# EAGLE design obc_v2_rev_6 (EAGLE 7.3.0)
OBC with integrated microcontroller
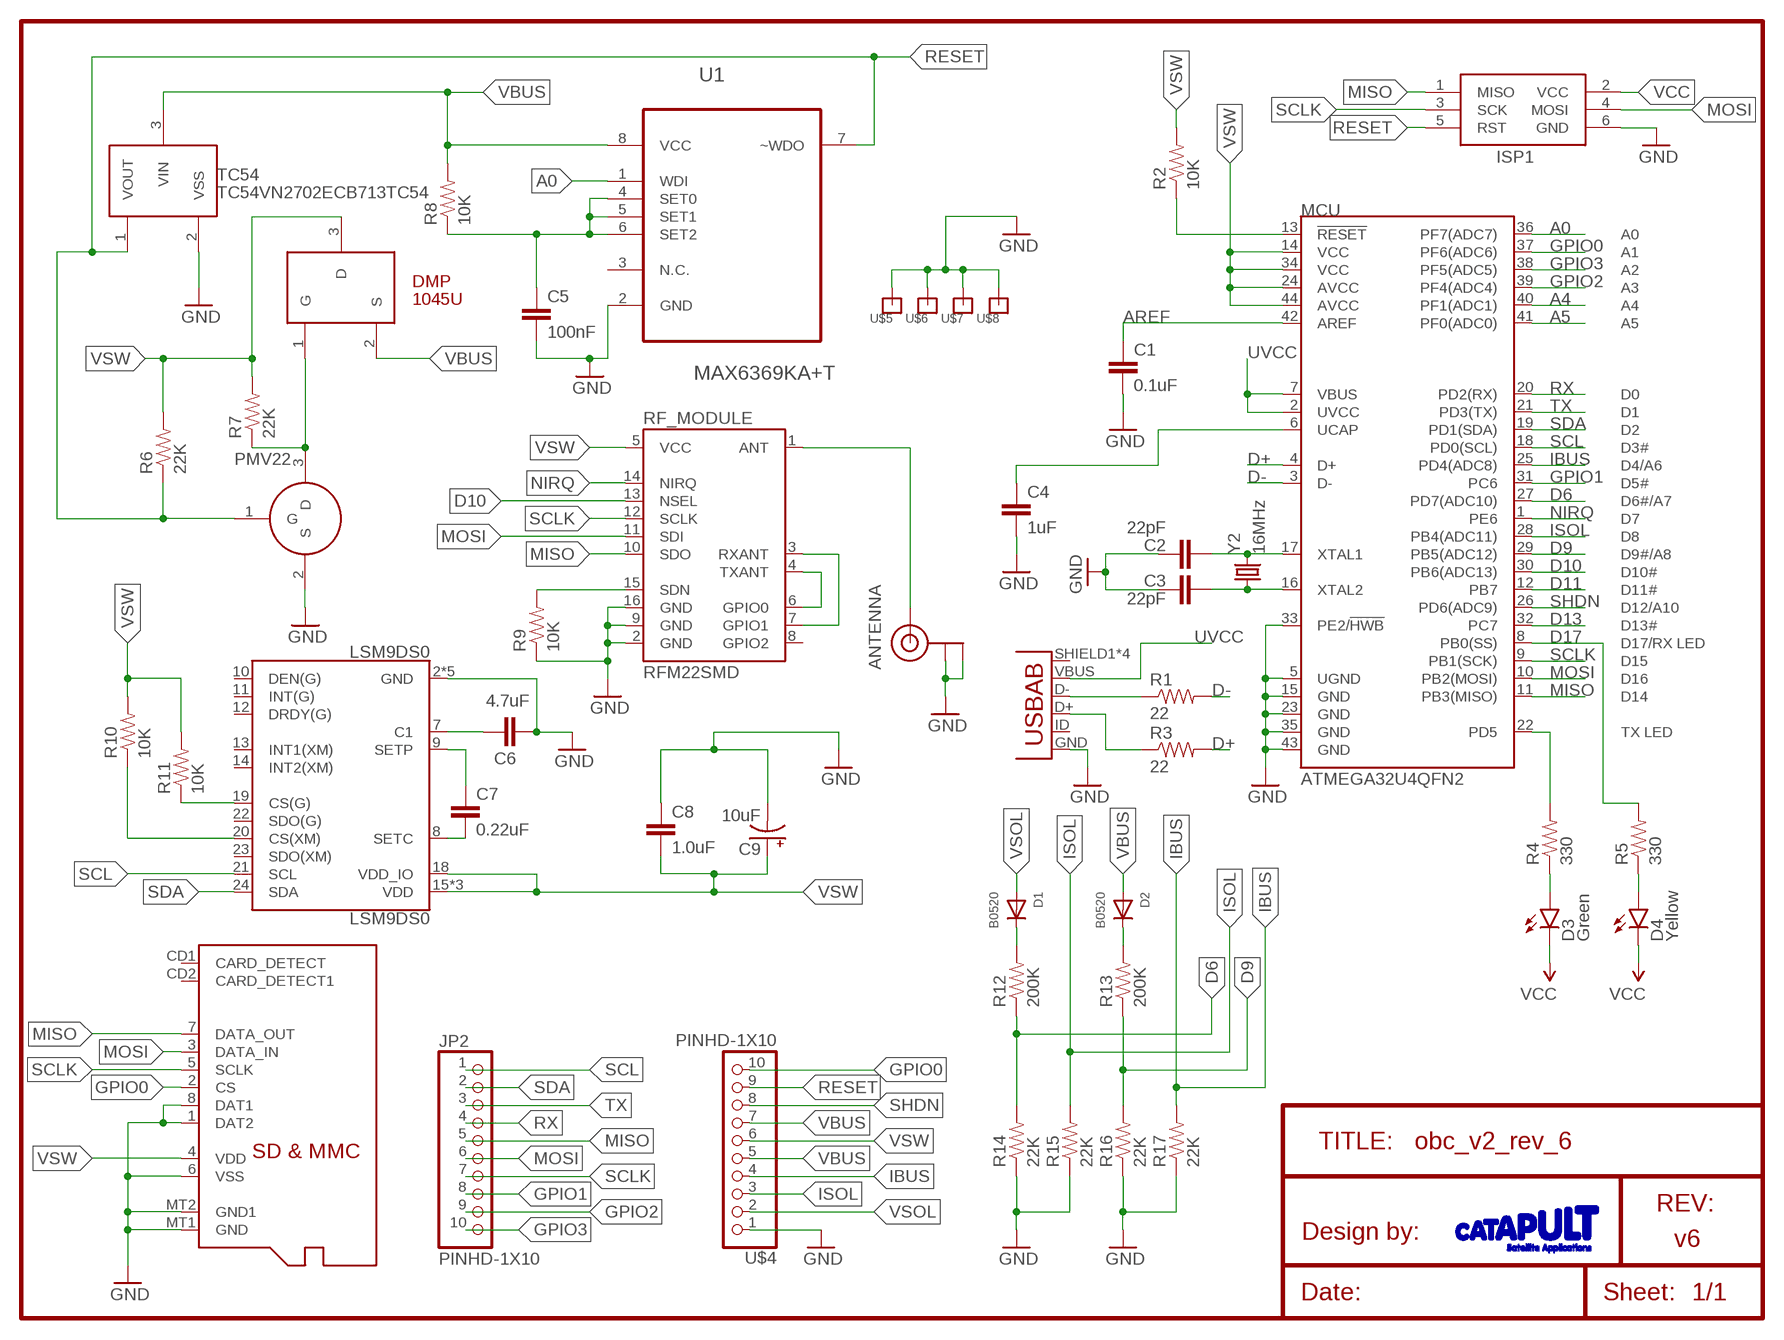
[diagram p0: schematic, sheet 1]

## Parts
ANTENNA  U.FL  [U.FL]
C1  0.1uF  CAP0603-CAP  [0603-CAP]
C2  22pF  CAP0603-CAP  [0603-CAP]
C3  22pF  CAP0603-CAP  [0603-CAP]
C4  1uF  CAP0603-CAP  [0603-CAP]
C5  100nF  CAP0402-CAP  [0402-CAP]
C6  4.7uF  CAP0402-CAP  [0402-CAP]
C7  0.22uF  CAP0402-CAP  [0402-CAP]
C8  1.0uF  CAP0402-CAP  [0402-CAP]
C9  10uF  CAP_POL1206  [EIA3216]
D1  B0520  DIODESOD-123  [SOD-123]
D2  B0520  DIODESOD-123  [SOD-123]
D3  Green  LED0603  [LED-0603]
D4  Yellow  LED0603  [LED-0603]
DMP  1045U  DMP1045USMD  [SOT-23_DMP]
ISP1  AVRISP-6  [AVRISP]
JP1  USB-AB  [USB-AB-MICRO-SMD]
JP2  PINHD-1X10  [1X10-BIG]
LSM9DS0  LSM9DS0  [LGA-24]
MCU  ATMEGA32U4QFN2  [QFN-44-NOPAD]
PMV22  PMV22SMD  [SOT-23]
R1  22  RESISTOR0603-RES  [0603-RES]
R2  10K  RESISTOR0603-RES  [0603-RES]
R3  22  RESISTOR0603-RES  [0603-RES]
R4  330  RESISTOR0603-RES  [0603-RES]
R5  330  RESISTOR0603-RES  [0603-RES]
R6  22K  RESISTOR0402-RES  [0402-RES]
R7  22K  RESISTOR0402-RES  [0402-RES]
R8  10K  RESISTOR0402-RES  [0402-RES]
R9  10K  RESISTOR0402-RES  [0402-RES]
R10  10K  RESISTOR0402-RES  [0402-RES]
R11  10K  RESISTOR0402-RES  [0402-RES]
R12  200K  RESISTOR0402-RES  [0402-RES]
R13  200K  RESISTOR0402-RES  [0402-RES]
R14  22K  RESISTOR0402-RES  [0402-RES]
R15  22K  RESISTOR0402-RES  [0402-RES]
R16  22K  RESISTOR0402-RES  [0402-RES]
R17  22K  RESISTOR0402-RES  [0402-RES]
RF_MODULE  RFM22SMD  [RFM22-XXX-S2]
SD  MICROSD  [MICROSD]
TC54  TC54VN2702ECB713TC54  [SOT-23A]
U1  MAX6369KA+T  [SOT65P280X145-8N]
U$4  PINHD-1X10  [1X10-BIG]
U$5  3MMPILAR  [3MMPILAR]
U$6  3MMPILAR  [3MMPILAR]
U$7  3MMPILAR  [3MMPILAR]
U$8  3MMPILAR  [3MMPILAR]
Y2  16MHz  CRYSTAL5X3  [CRYSTAL-SMD-5X3]

## Nets
A0: MCU.36(PF7(ADC7)) U1.1(WDI)
A4: MCU.40(PF1(ADC1))
A5: MCU.41(PF0(ADC0))
AREF: C1.1 MCU.42(AREF)
D6: MCU.27(PD7(ADC10)) R12.1 R14.2
D9: MCU.29(PB5(ADC12)) R13.1 R16.2
D10: MCU.30(PB6(ADC13)) RF_MODULE.13(NSEL)
D11: MCU.12(PB7)
D13: MCU.32(PC7)
D17: MCU.8(PB0(SS)) R5.2
D+: MCU.4(D+) R3.2
D-: MCU.3(D-) R1.2
GND: ANTENNA.P$1(GND) ANTENNA.P$2(GND) C1.2 C2.1 C3.1 C4.2 C5.2 C6.1 C8.1 C9.C(-) ISP1.6(GND) JP1.GND LSM9DS0.2(GND) LSM9DS0.3(GND) LSM9DS0.4(GND) LSM9DS0.5(GND) LSM9DS0.6(GND) MCU.5(UGND) MCU.15(GND) MCU.23(GND) MCU.33(PE2/!HWB) MCU.35(GND) MCU.43(GND) PMV22.2(S) R9.1 R14.1 R15.1 R16.1 R17.1 RF_MODULE.2(GND) RF_MODULE.9(GND) RF_MODULE.16(GND) SD.1(DAT2) SD.6(VSS) SD.8(DAT1) SD.MT1(GND) SD.MT2(GND1) TC54.2(VSS) U1.2(GND) U$4.1 U$5.P$1 U$6.P$1 U$7.P$1 U$8.P$1
GPIO0: MCU.37(PF6(ADC6)) SD.2(CS) U$4.10
GPIO1: JP2.8 MCU.31(PC6)
GPIO2: JP2.9 MCU.39(PF4(ADC4))
GPIO3: JP2.10 MCU.38(PF5(ADC5))
IBUS: MCU.25(PD4(ADC8)) R17.2 U$4.4
ISOL: MCU.28(PB4(ADC11)) R15.2 U$4.3
MISO: ISP1.1(MISO) JP2.5 MCU.11(PB3(MISO)) RF_MODULE.10(SDO) SD.7(DATA_OUT)
MOSI: ISP1.4(MOSI) JP2.6 MCU.10(PB2(MOSI)) RF_MODULE.11(SDI) SD.3(DATA_IN)
N$1: MCU.13(!RESET) R2.1
N$2: C4.1 MCU.6(UCAP)
N$3: C3.2 MCU.16(XTAL2) Y2.1
N$4: C2.2 MCU.17(XTAL1) Y2.3
N$5: JP1.D+ R3.1
N$6: JP1.D- R1.1
N$7: MCU.22(PD5) R4.2
N$8: DMP.1(G) PMV22.3(D) R7.1
N$9: D4.A R5.1
N$10: D3.A R4.1
N$11: C5.1 R8.1 U1.4(SET0) U1.5(SET1) U1.6(SET2)
N$12: RF_MODULE.4(TXANT) RF_MODULE.6(GPIO0)
N$13: RF_MODULE.3(RXANT) RF_MODULE.7(GPIO1)
N$14: ANTENNA.P$3(SIGNAL) RF_MODULE.1(ANT)
N$15: C6.2 LSM9DS0.7(C1)
N$16: R9.2 RF_MODULE.15(SDN)
N$17: D1.C R12.2
N$18: LSM9DS0.19(CS(G)) R11.1
N$19: LSM9DS0.20(CS(XM)) R10.1
N$20: C7.1 LSM9DS0.9(SETP)
N$21: C7.2 LSM9DS0.8(SETC)
N$26: D2.C R13.2
NIRQ: MCU.1(PE6) RF_MODULE.14(NIRQ)
RESET: ISP1.5(RST) PMV22.1(G) R6.1 TC54.1(VOUT) U1.7(~WDO) U$4.9
RX: JP2.4 MCU.20(PD2(RX))
SCL: JP2.1 LSM9DS0.21(SCL) MCU.18(PD0(SCL))
SCLK: ISP1.3(SCK) JP2.7 MCU.9(PB1(SCK)) RF_MODULE.12(SCLK) SD.5(SCLK)
SDA: JP2.2 LSM9DS0.24(SDA) MCU.19(PD1(SDA))
SHDN: MCU.26(PD6(ADC9)) U$4.8
TX: JP2.3 MCU.21(PD3(TX))
UVCC: JP1.VBUS MCU.2(UVCC) MCU.7(VBUS)
VBUS: D2.A DMP.2(S) R8.2 TC54.3(VIN) U1.8(VCC) U$4.5 U$4.7
VCC: D3.C D4.C ISP1.2(VCC)
VSOL: D1.A U$4.2
VSW: C8.2 C9.A(+) DMP.3(D) LSM9DS0.15(VDD) LSM9DS0.16(VDD) LSM9DS0.17(VDD) LSM9DS0.18(VDD_IO) MCU.14(VCC) MCU.24(AVCC) MCU.34(VCC) MCU.44(AVCC) R2.2 R6.2 R7.2 R10.2 R11.2 RF_MODULE.5(VCC) SD.4(VDD) U$4.6
Unconnected: JP1.ID(USBID) JP1.SHIELD1(SHIELD) JP1.SHIELD2(SHIELD) JP1.SHIELD3(SHIELD) JP1.SHIELD4(SHIELD) LSM9DS0.10(DEN(G)) LSM9DS0.11(INT(G)) LSM9DS0.12(DRDY(G)) LSM9DS0.13(INT1(XM)) LSM9DS0.14(INT2(XM)) LSM9DS0.22(SDO(G)) LSM9DS0.23(SDO(XM)) RF_MODULE.8(GPIO2) SD.CD1(CARD_DETECT) SD.CD2(CARD_DETECT1) U1.3(N.C.)

## Notes on the sheet
- TITLE:
- REV:
- Design by:
- v6
- Date: | Sheet:
- C:/Users/George.Addison/Documents/hardware/Electronic/PCB Designs/SA_LG_Black.bmp

## Library data of the parts
ANTENNA = SparkFun-Connectors:U.FL: SMD antenna connector- WRL-09144; PROD_ID: CONN-09193
C1-C8 = SparkFun-Capacitors:CAP: Capacitor Standard 0603 ceramic capacitor, and 0.1" leaded capacitor.
C9 = SparkFun-Capacitors:CAP_POL: Capacitor Polarized These are standard SMD and PTH capacitors. Normally 10uF, 47uF, and 100uF in electrolytic and tantalum varieties. Always verify the external diameter of the through hole cap, it varies with capacity, voltage, and manufacturer. The EIA devices should be standard.
D1 D2 = adafruit:DIODE: Diode SMADIODE - SMA Surface Mount Package 20V 1A Schottky Diode Digikey: 641-1014-6-ND DO-1N4148 - Through Hole Small Current Diode SOD-123 20V 1 A (.5mV Vf) Schottky Diode - Digikey: MBRX120TPMSCT-ND SOD-323 10V 570mA (.38mV Vf, 3ns) Schottky Diode - Digikey: ZLLS410CT-ND SOD-523 30V 30mA Schottky Diode (RB751S-40TE61) - Digikey: RB751S-40TE61CT-ND SOT23-R/W - SOT23 Package (R = Solder Paste/Reflow Ovens, W = Hand-Soldering) BAT54Film 40V 300mA - Digikey: 497-7162-1-ND
D3 D4 = SparkFun-LED:LED: LEDs Standard schematic elements and footprints for 5mm, 3mm, 1206, and 0603 sized LEDs. 5mm - Spark Fun Electronics SKU : COM-00529 (and others)
DMP = OBC:DMP1045U: P-CHANNEL ENHANCEMENT MODE MOSFET
ISP1 = adafruit:AVRISP: AVR ISP HEADER Standard 6 pin header for AVR programming
JP1 = SparkFun-Connectors:USB-AB: This is a USB AB connector that is compatible with USB OTG. i.e. this connector can serve as a host or device
JP2 U$4 = adafruit:PINHD-1X10: Pin header 1x10 0.1" spacing With round pins
LSM9DS0 = SparkFun-DigitalIC:LSM9DS0: LSM9DS0 3D Accelerometer, 3D Gyroscope, 3D Magnetomter Features: 3 acceleration channels, 3 angular rate channels, 3 magnetic field channels ±2/±4/±6/±8/±16 g linear acceleration full scale ±2/±4/±8/±12 gauss magnetic full scale ±245/±500/±2000 dps angular rate full scale 16-bit data output SPI / I2C serial interfaces Analog supply voltage 2.4 V to 3.6 V Power-down mode / low-power mode Programmable interrupt generators Embedded self-test Embedded temperature sensor Embedded FIFO Position and motion detection functions Click/double-click recognition
MCU = SparkFun-DigitalIC:ATMEGA32U4: Atmel 44-pin 8-bit Microcontroller with 32KBytes of ISP Flash and USB Controller
PMV22 = OBC:PMV22
R1-R17 = SparkFun-Passives:RESISTOR: Resistor Basic schematic elements and footprints for 0603, 1206, and PTH resistors.
RF_MODULE = SparkFun-RF:RFM22: The RFM22 is a low-power, low cost radio that is capable of operating in the 434MHz and 900MHz open bands. It's frequency is software defined and there are some very good libraries written for it.
SD = adafruit:MICROSD: Micro-SD / Transflash card holder with SPI pinout For the 3M # 2908-05WB-MG and/or 4UCON #19656 push-push type
TC54 = OBC:TC54VN2702ECB713: VOLTAGE DETECTOR, 3.6UA, 10V, SMD-3
U1 = Maxim_By_element14_Batch_1:MAX6369KA+T: Pin-Selectable Watchdog Timers; MPN: MAX6369KA+T; OC_FARNELL: 1787051; OC_NEWARK: 68K9450; PACKAGE: SOT23-8; SUPPLIER: Maxim
U$5-U$8 = LMA:3MMPILAR
Y2 = SparkFun-FreqCtrl:CRYSTAL: Various standard crystals. Proven footprints.; PROD_ID: XTAL-08218

## Board
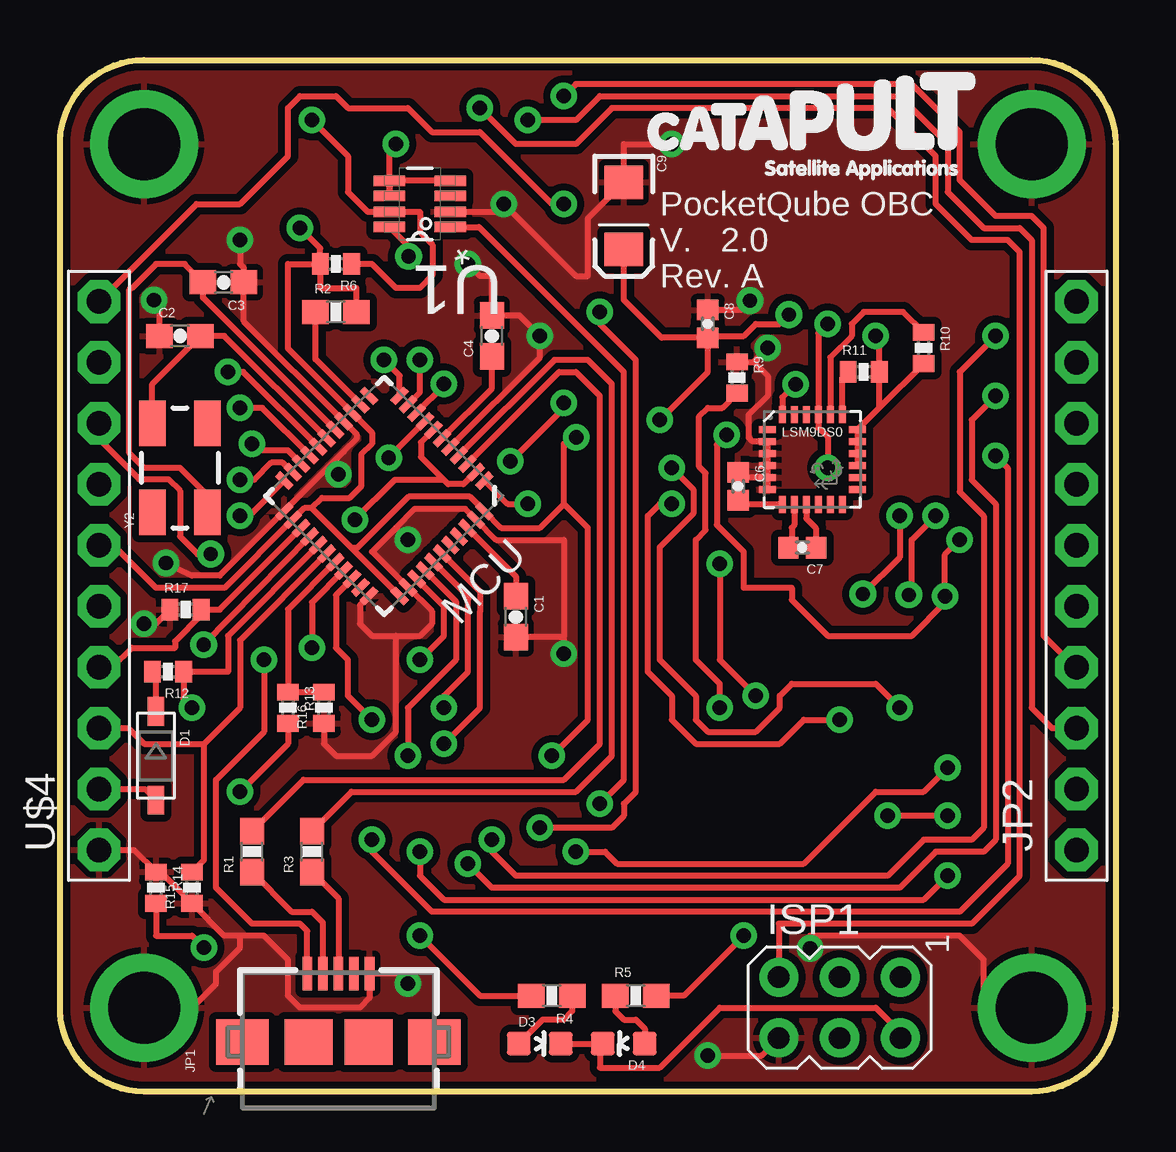
[diagram p1: board, top side]
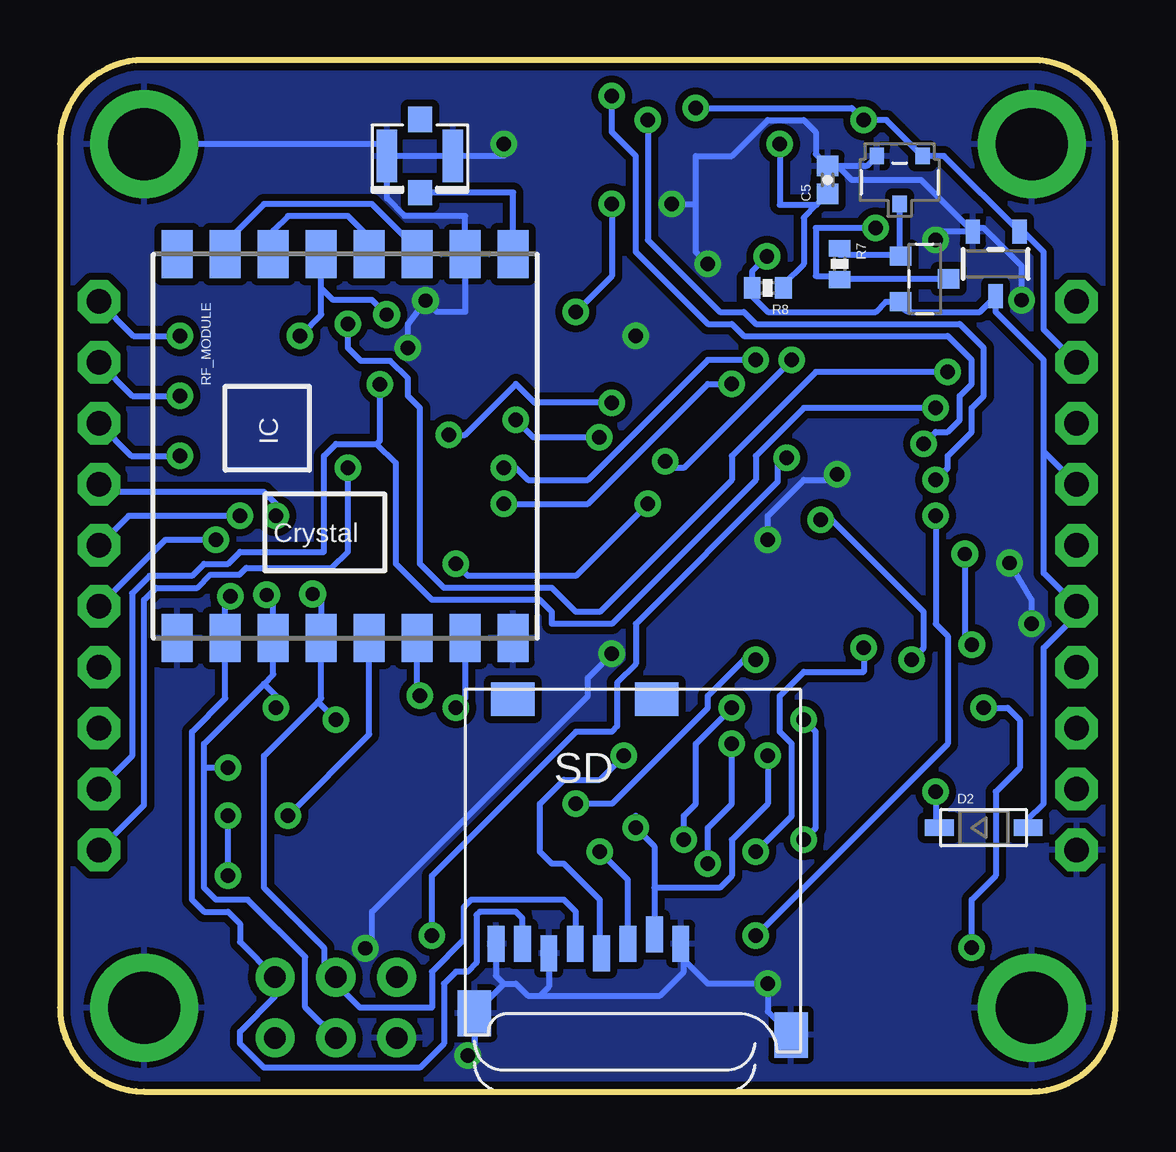
[diagram p2: board, bottom side, seen from below]

Size 44 x 43 mm. Coordinates in mm from the lower left corner, seen from the top.
Outline: 0,3.5 0,39.5 arc-90 3.5,43 40.5,43 arc-90 44,39.5 44,3.5 arc-90 40.5,0 3.5,0 arc-90 0,3.5
Copper layers (1*16): Top 0.035mm / dielectric 1.5mm / Bottom 0.035mm
Design rules "pcbtrain *": minimum track width 0.2mm, minimum drill 0.4mm, track to track 0.2mm, track to pad 0.2mm, pad to pad 0.2mm, via to via 0.2mm, smd to smd 0mil, copper to edge 10mil, drill to drill 0.2mm, minimum pad ring 10mil, minimum via ring 10mil, stop-mask expansion 0.125mm, vias tented up to drill 25mil, thermal gap 10mil

### Footprints (pad centres in the part's own frame; a part is rotated, then mirrored left to right if it is on the bottom)
U.FL = smd 2.2 x 0.85: P$1 0,1.375; P$2 0,-1.375 | smd 1.05 x 1: P$3 1.525,0; P$4 -1.525,0
0603-CAP = smd 1.1 x 1: 1 -0.85,0; 2 0.85,0
0402-CAP = smd 0.85 x 0.9: 1 -0.58,0; 2 0.58,0
EIA3216 = smd 1.4 x 1.6: A 1.4,0; C -1.4,0
SOD-123 = smd 1.2 x 0.7: A 1.85,0; C -1.85,0
LED-0603 = smd 1 x 1: A 0,-0.877; C 0,0.877
SOT-23_DMP = smd 0.8 x 0.9: 1 -0.95,-1; 2 0.95,-1; 3 0,1
AVRISP = drill 0.9 pad 1.626: 1 -1.27,2.54; 2 1.27,2.54; 3 -1.27,0; 4 1.27,0; 5 -1.27,-2.54; 6 1.27,-2.54
USB-AB-MICRO-SMD = smd 1.4 x 0.4: D+ 2.85,0; D- 2.85,0.65; GND 2.85,-1.3; ID 2.85,-0.65; VBUS 2.85,1.3 | smd 1.9 x 2.2: SHIELD1 0,4; SHIELD4 0,-4 | smd 1.9 x 2: SHIELD2 0,1.25; SHIELD3 0,-1.25
1X10-BIG = drill 1.016 pad 1.778 octagon: 1 -11.43,0; 2 -8.89,0; 3 -6.35,0; 4 -3.81,0; 5 -1.27,0; 6 1.27,0; 7 3.81,0; 8 6.35,0; 9 8.89,0; 10 11.43,0
LGA-24 = smd 0.7 x 0.29: 1 -1.875,1.25; 2 -1.875,0.75; 3 -1.875,0.25; 4 -1.875,-0.25; 5 -1.875,-0.75; 6 -1.875,-1.25; 13 1.875,-1.25; 14 1.875,-0.75; 15 1.875,-0.25; 16 1.875,0.25; 17 1.875,0.75; 18 1.875,1.25 | smd 0.29 x 0.7: 7 -1.25,-1.875; 8 -0.75,-1.875; 9 -0.25,-1.875; 10 0.25,-1.875; 11 0.75,-1.875; 12 1.25,-1.875; 19 1.25,1.875; 20 0.75,1.875; 21 0.25,1.875; 22 -0.25,1.875; 23 -0.75,1.875; 24 -1.25,1.875
QFN-44-NOPAD = smd 0.8 x 0.3: 1 -3.4,2.5; 2 -3.4,2; 3 -3.4,1.5; 4 -3.4,1; 5 -3.4,0.5; 6 -3.4,0; 7 -3.4,-0.5; 8 -3.4,-1; 9 -3.4,-1.5; 10 -3.4,-2; 11 -3.4,-2.5; 23 3.4,-2.5; 24 3.4,-2; 25 3.4,-1.5; 26 3.4,-1; 27 3.4,-0.5; 28 3.4,0; 29 3.4,0.5; 30 3.4,1; 31 3.4,1.5; 32 3.4,2; 33 3.4,2.5 | smd 0.3 x 0.8: 12 -2.5,-3.4; 13 -2,-3.4; 14 -1.5,-3.4; 15 -1,-3.4; 16 -0.5,-3.4; 17 0,-3.4; 18 0.5,-3.4; 19 1,-3.4; 20 1.5,-3.4; 21 2,-3.4; 22 2.5,-3.4; 34 2.5,3.4; 35 2,3.4; 36 1.5,3.4; 37 1,3.4; 38 0.5,3.4; 39 0,3.4; 40 -0.5,3.4; 41 -1,3.4; 42 -1.5,3.4; 43 -2,3.4; 44 -2.5,3.4
SOT-23 = smd 0.6 x 0.7: 1 0.95,1; 2 -0.95,1; 3 0,-1
0603-RES = smd 1.1 x 1: 1 -0.85,0; 2 0.85,0
0402-RES = smd 0.7 x 0.9: 1 -0.65,0; 2 0.65,0
RFM22-XXX-S2 = smd 2 x 1.3: 1 -8,7; 2 -8,5; 3 -8,3; 4 -8,1; 5 -8,-1; 6 -8,-3; 7 -8,-5; 8 -8,-7; 9 8,-7; 10 8,-5; 11 8,-3; 12 8,-1; 13 8,1; 14 8,3; 15 8,5; 16 8,7
MICROSD = smd 0.7 x 1.5: 1 9,-10.64; 2 7.9,-10.24; 3 6.8,-10.64; 4 5.7,-11.04; 5 4.6,-10.64; 6 3.5,-11.04; 7 2.4,-10.64; 8 1.3,-10.64 | smd 1.8 x 1.4: CD1 2,-0.44; CD2 8,-0.44 | smd 1.4 x 1.9: MT1 0.4,-13.54; MT2 13.6,-14.44
SOT-23A = smd 0.6 x 1: 1 -1,-1.35; 2 0.95,-1.35; 3 0,1.35
SOT65P280X145-8N = smd 1.321 x 0.432: 1 -1.27,0.965; 2 -1.27,0.33; 3 -1.27,-0.33; 4 -1.27,-0.965; 5 1.27,-0.965; 6 1.27,-0.33; 7 1.27,0.33; 8 1.27,0.965
3MMPILAR = drill 3 pad 4.5: P$1 0,0
CRYSTAL-SMD-5X3 = smd 1.9 x 1.1: 1 -1.85,-1.15; 2 1.85,-1.15; 3 1.85,1.15; 4 -1.85,1.15

### Placement (x,y rotation side)
ANTENNA  29,39 270 bottom
C1  19,19.79 270 top
C2  5,31.5 0 top
C3  6.82,33.73 180 top
C4  18,31.5 90 top
C5  12,38 90 bottom
C6  28.27,25.23 270 top
C7  30.95,22.68 180 top
C8  27,32 270 top
C9  23.5,36.5 270 top
D1  4,14 270 top
D2  5.5,11 0 bottom
D3  20,2 270 top
D4  23.5,2 90 top
DMP  7.96,33.88 270 bottom
ISP1  32.5,3.5 270 top
JP1  11.61,2.07 90 top
JP2  42.38,21.5 90 top
LSM9DS0  31.36,26.35 0 top
MCU  13.52,24.83 225 top
PMV22  9,38 0 bottom
R1  8,10 90 top
R2  11.5,32.5 0 top
R3  10.5,10 90 top
R4  20.5,4 180 top
R5  24,4 0 top
R6  11.5,34.5 180 top
R7  11.5,34.5 270 bottom
R8  14.5,33.5 180 bottom
R9  28.23,29.77 270 top
R10  36,31 270 top
R11  33.5,30 0 top
R12  4.5,17.5 180 top
R13  9.5,16 270 top
R14  4,8.5 270 top
R15  5.5,8.5 90 top
R16  11,16 90 top
R17  5.24,20.09 0 top
RF_MODULE  32.11,26.9 270 bottom
SD  27.12,16.8 0 bottom
TC54  5,34.5 180 bottom
U1  15,37 180 top
U$3  [SA_LOGO]  24.5,38 0 top
U$4  1.62,21.5 90 top
U$5  40.5,39.5 0 top
U$6  3.5,39.5 0 top
U$7  40.5,3.5 0 top
U$8  3.5,3.5 0 top
Y2  5,26 90 top

### Tracks (layer width: path | path; a pad name or v marks a point on that pad's centre or on a via)
A0  (via drill 0.6)
  Top 0.254: U1.1 17.46,36.03 23.5,30 23.5,13 v22.5,12 | v15,18 16,19 16,20.23 MCU.36
  Bottom 0.254: v15,18 15.5,18 17,16.5 17,16 21,12 v22.5,12
AREF
  Top 0.254: MCU.42 19,21.47 C1.1
D6  (via drill 0.6)
  Top 0.254: 5.48,17.5 R12.1 | R12.1 5.15,16.35 v5.5,16 | v6,6 5.5,6.5 4,6.5 R14.2 | MCU.27 10.76,22.76 7,19 7,17.5 R12.1
  Bottom 0.254: v5.5,16 4.5,16 4,15.5 4,13.5 5,12.5 5,9 6,8 v6,6
D9
  Top 0.254: MCU.29 9.5,20.1 R13.1 R16.2
D10  (via drill 0.6)
  Top 0.254: MCU.30 10.5,20.4 v10.5,18.5 | v15,10 15,9 16,8 36,8 v37,9 | v37,11.5 v34.5,11.5
  Bottom 0.254: v10.5,18.5 10.5,17.5 13,17.5 14,16.5 14,15 13.5,14.5 13.5,11.5 v15,10 | v37,9 v37,11.5 | v34.5,11.5 31.11,14.89 RF_MODULE.13
D17  (via drill 0.6)
  Top 0.254: MCU.8 13.7,26.42 v13.7,26.41 | v28.5,6.5 26,4 R5.2
  Bottom 0.254: v13.7,26.41 14.09,26.41 14.09,25.41 20,19.5 20,17.82 20.78,17.05 20.78,15.22 21,15 22.5,15 28.5,9 v28.5,6.5
D+
  Top 0.254: R3.2 12.15,12.5 21.5,12.5 23,14 23,29.5 22,30.5 20.6,30.5 MCU.4
D-
  Top 0.254: R1.2 10.15,13 21,13 22.5,14.5 22.5,29 21.5,30 20.81,30 MCU.3
GND  (via drill 0.6)
  Top 0.254: v7.5,35.5 7.5,34.5 7.67,34.34 C3.1 7.67,32.1 MCU.15 12.38,27.38 12.38,27.23 11.83,26.67 | 11.33,26.17 MCU.23 6.66,21.51 5.49,21.51 v4.41,22.03 | 11.33,26.17 11.83,26.67 | 14,23.5 13,22.5 13.02,22.5 MCU.35 15.5,20.02 15.5,19.5 15,19 14,19 | v17,34.5 17.5,34 18,34 C4.2 19.15,32.35 v20,31.5 20,30.6 MCU.5 | U1.2 18.17,36.67 v18.5,37 21.5,34 22,34 22,36.4 C9.C 23.5,39.5 v25.5,39.5 | MCU.33 12.5,20.27 12.5,19.5 13,19 14,19 | R16.1 11,14.5 11.5,14 13,14 14,15 14,19 | v27,1.5 29.23,1.5 ISP1.6 | 21,18.94 21,23 18.18,23 MCU.43 16.89,24.29 14.79,24.29 14,23.5 | 21,18.94 C1.2 | LSM9DS0.5 28.48,25.6 C6.1 | LSM9DS0.5 LSM9DS0.4 LSM9DS0.3 LSM9DS0.2 28.86,27.1 28.71,27.25 28.71,28.21 29.5,29 29.5,29.83 28.91,30.41 | LSM9DS0.5 LSM9DS0.6 | v14.5,4.5 14.08,4.92 JP1.GND 12.9,3.9 12.5,3.5 10,3.5 9.5,4 9.5,5.5 8.5,6.5 7.5,6.5 | 7.5,6.5 6.85,6.5 R15.1 4.2,9.15 R14.1 3.08,10.07 U$4.1 | U$8.P$1 5.5,3.5 6.5,4.5 6.5,5 7.5,6 7.5,6.5 | U$7.P$1 38.5,3.5 38.5,5.5 37.5,6.5 31.27,6.5 v31.27,5.97 | 14,23.5 v14.5,23 | 11.83,26.67 11.54,26.37 | v11.6,25.73 11.33,26 11.33,26.17 | C2.1 4.15,32.76 v3.92,32.99 | R9.1 28.91,30.41 | 28.91,30.41 v29.5,31 | v28.76,32.97 28.37,32.58 C8.1 | v21,18.25 21,18.94 | v3.5,19.5 4,19.5 R17.1
  Bottom 0.254: TC54.2 8.1,38 11,38 11.58,38.58 C5.2 | TC54.2 7.15,35.85 v7.5,35.5 | PMV22.2 10.37,38.58 C5.2 | v3.5,19.5 3.5,20.5 v4.41,22.03 | v17,34.5 17.5,35 17.5,37 | 17.5,37 17.5,39 16,39 14.5,40.5 13,40.5 12.5,40 12.5,39.08 C5.2 | v18.5,37 17.5,37 | v27,1.5 26.73,1.77 SD.MT1 25.5,4.49 25.5,4.5 | SD.8 25.82,4.83 25.5,4.5 | 25.5,4.5 25,4.5 24.5,4 24,4 | 24,4 19,4 18,5 18,5.5 | 18,5.5 18,6.04 SD.1 | RF_MODULE.16 25.11,18 | ANTENNA.P$2 30.5,39 30.5,39.5 U$5.P$1 | ANTENNA.P$2 ANTENNA.P$1 25.5,39 v25.5,39.5 | ANTENNA.P$2 30.38,37.23 29.64,36.5 27.11,36.5 RF_MODULE.2 27.11,32.5 28.29,32.5 v28.76,32.97 29.5,32 v29.5,31 | SD.MT2 14.5,3.33 v14.5,4.5 17,4.5 18,5.5 | SD.6 23.62,4.38 24,4 | v31.27,5.97 31,5.97 31,7.5 22,16.5 22,17.25 v21,18.25 | TC54.2 5.8,36 5.5,36 3.92,34.41 v3.92,32.99 | v14.5,23 14.5,24 13,25.5 11.83,25.5 v11.6,25.73
  pour Top (isolate 0.3): 0,0 0,43 44,43 44,0
  pour Bottom (isolate 0.3): 0,0 0,43 44,43 44,0
GPIO0  (via drill 0.6)
  Top 0.254: U$4.10 5.7,37 7.5,37 9.5,39 9.5,41 10,41.5 11.5,41.5 12,41 14.5,41 15.5,40 17.5,40 20.5,37 v21,37 | MCU.37 16.5,20.44 16.5,18 14.5,16 v14.5,14 | v20,11 23,11 23.5,11.5 23.5,12 24,12.5 24,30.5 22.5,32 v22.5,32.5
  Bottom 0.254: 19.23,8.5 19.23,10.22 v20,11 20,11.5 | 19.23,8.5 SD.2 | v14.5,14 14.5,12 16,10.5 16,9 16.5,8.5 19.23,8.5 | v21,37 21,34 v22.5,32.5
GPIO1  (via drill 0.6)
  Top 0.254: v39,26.5 39.5,26 39.5,9.5 37.5,7.5 15.5,7.5 13,10 v13,10.5 | MCU.31 11.5,20.69 11.5,18.5 12,18 12,16.5 v13,15.5
  Bottom 0.254: JP2.8 41.02,26.5 v39,26.5 | v13,10.5 12.5,11 12.5,15 v13,15.5
GPIO2  (via drill 0.6)
  Top 0.254: v39,29 38,28 38,25.5 39,24.5 39,10.5 38.5,10 36.5,10 35,8.5 18,8.5 v17,9.5 | v16,14.5 17.5,16 17.5,19.5 17.5,20 17.5,20.85 MCU.39
  Bottom 0.254: JP2.9 40.98,29 v39,29 | v17,9.5 17,11 16,12 v16,14.5
GPIO3  (via drill 0.6)
  Top 0.254: v39,31.5 37.5,30 37.5,25 38.5,24 38.5,11 38,10.5 36,10.5 34.5,9 19,9 18,10 v18,10.5 | v16,16 16,16.5 17,17.5 17,20 17,20.5 17,20.64 MCU.38
  Bottom 0.254: JP2.10 40.95,31.5 v39,31.5 | v18,10.5 18,11.5 17.5,12 17.5,14.5 v16,16
IBUS
  Top 0.254: MCU.25 6.66,20.09 R17.2 5.88,19.86 4.79,18.77 4.79,18.5 3,18.5 2.19,17.69 U$4.4
ISOL
  Top 0.254: U$4.3 2.85,15.15 3.5,14.5 6,14.5 | R15.2 6,9.65 6,14.5 | MCU.28 7.5,18.81 7.5,16 6,14.5
MISO  (via drill 0.6)
  Top 0.254: MCU.11 14.16,29.84 v13.5,30.5 | 21,28.5 v21,28.71 21,28.5 v18.77,26.27 | 37.23,22.73 v37.5,23 36.9,22.39 v36.9,20.65 36.9,20.38 35.52,19 32,19 30.5,20.5 30.5,21 28.5,21 28.5,22.5 27.38,23.62 27.38,26.96 v27.79,27.38
  Bottom 0.254: v13.5,30.5 18,26 18.5,26 v18.77,26.27 | SD.7 24.73,7.22 25,7.5 26.5,7.5 26.64,7.36 26.64,5.36 27,5 27.5,5 28,4.5 28,2 29,1 35.5,1 36.5,2 36.5,2.5 35.04,3.96 ISP1.1 36.5,6.23 36.5,7 37,7.5 38,7.5 38.5,8 38.5,15 37.11,16.39 RF_MODULE.10 37.11,20.43 v36.9,20.65 | 42.1,20.5 JP2.5 39.6,23 v37.5,23 | v21,28.71 24.21,28.71 25,29.5 27.12,27.38 v27.79,27.38
MOSI  (via drill 0.6)
  Top 0.254: MCU.10 15,29.14 v15,30.5 | v21.5,10 22.73,10 23.23,9.5 31,9.5 34,12.5 36,12.5 v37,13.5 | v35,16 34,17 30.5,17 30,16.5 30,16 29,15 27,15 26.5,15.5 26.5,16.5 25,18 25,22.69 26.4,24.09 26.4,25.1 v25.5,26 | v36.5,24 35.5,23 35.5,20.82 v35.38,20.7
  Bottom 0.254: ISP1.4 33.78,3.51 33.78,5.61 36.17,8 37.5,8 38,8.5 38,13.5 | SD.3 20.32,8.82 v21.5,10 | 38,13.5 38,14.5 35.5,17 | 35.5,17 35.11,17.39 RF_MODULE.11 35.11,20.61 35.2,20.7 v35.38,20.7 | v37,13.5 38,13.5 | v35,16 35,16.5 35.5,17 | v25.5,26 25,26 24.5,25.5 22,25.5 17,30.5 v15,30.5 | v36.5,24 41.15,24 JP2.6
N$1
  Top 0.254: MCU.13 10.65,30.53 R2.1
N$2
  Top 0.254: MCU.6 18,29.31 C4.1
N$3
  Top 0.254: MCU.16 5.96,33.09 C3.2 5.2,34.5 4,34.5 3,33.5 arc90 2.89,33.39 2.89,26.61 3.5,26 5,26 6.15,24.85 Y2.1
N$4
  Top 0.254: MCU.17 6.85,31.5 C2.2 3.85,29.5 Y2.3
N$5
  Top 0.254: R3.1 11.61,8.04 JP1.D+
N$6
  Top 0.254: R1.1 9.65,7.5 10.5,7.5 10.96,7.04 JP1.D-
N$7  (via drill 0.6)
  Top 0.254: MCU.22 7.88,24 v7.5,24 | v15,6.5 17.5,4 R4.2
  Bottom 0.254: v7.5,24 7.5,19.5 7,19 7,14.5 v15,6.5
N$8
  Bottom 0.254: 9,34.87 PMV22.3 | 11.27,34.92 arc90 R7.1 11.5,34.87 9,34.87 | DMP.1 9,34.87
N$9
  Top 0.254: R5.1 23.15,3.35 23.5,3 24,3 24.38,2.62 D4.A
N$10
  Top 0.254: R4.1 21.35,3.35 21,3 20.12,3 D3.A
N$11  (via drill 0.6)
  Top 0.254: U1.4 16.3,38 16.5,38 16.46,37.97 U1.5 U1.6 13.73,39.5 v14,39.5
  Bottom 0.254: C5.1 12.46,36.96 | 12.46,36.96 13,36.42 13,34.5 13.85,33.65 R8.1 | v14,39.5 14,36.96 12.46,36.96
N$12
  Bottom 0.254: RF_MODULE.4 31.11,35.61 32,36.5 34.5,36.5 35.11,35.89 RF_MODULE.6
N$13
  Bottom 0.254: RF_MODULE.3 29.11,35.11 31,37 35.5,37 37,35.5 37,35.01 RF_MODULE.7
N$14
  Bottom 0.254: RF_MODULE.1 25.11,37.48 ANTENNA.P$3
N$15
  Top 0.254: LSM9DS0.7 28.44,24.48 C6.2
N$16  (via drill 0.6)
  Top 0.254: v27.5,16 27.5,17 26.5,18 26.5,23 26.91,23.41 26.91,25.78 26.64,26.05 26.64,28.14 27,28.5 27.61,28.5 R9.2
  Bottom 0.254: RF_MODULE.15 27.11,16.39 v27.5,16
N$17
  Top 0.254: D1.C 4,17.35 R12.2
N$18
  Top 0.254: LSM9DS0.19 32.61,29.76 R11.1
N$19
  Top 0.254: R10.1 35.15,32.5 33.5,32.5 33,32 33,31.5 32.11,30.61 LSM9DS0.20
N$20
  Top 0.254: LSM9DS0.9 31.11,23.89 31.5,23.5 31.5,22.7 C7.1
N$21
  Top 0.254: LSM9DS0.8 30.61,23.61 30.5,23.5 30.5,22.81 C7.2
N$26  (via drill 0.6)
  Top 0.254: R13.2 9.5,14.5 v7.5,12.5
  Bottom 0.254: v7.5,12.5 7.5,11.15 D2.C
NIRQ  (via drill 0.6)
  Top 0.254: MCU.1 18.66,24.5 v19.5,24.5 | v27.5,22 27.5,18 v29,16.5
  Bottom 0.254: v19.5,24.5 22.5,21.5 27,21.5 v27.5,22 | v29,16.5 29.11,16.61 RF_MODULE.14
RESET  (via drill 0.6)
  Top 0.254: v10.5,40.5 12,39 12,37.5 12.83,36.67 U1.7 15,36.67 15,35.83 15.53,35.3 15.53,34.02 15,33.5 14,33.5 13,34.5 R6.1 | v17.5,41 19,39.5 21.5,39.5 23,41 34.5,41 36.5,39 36.5,37 38,35.5 39.5,35.5 40,35 40,9 38,7 29.96,7 ISP1.5
  Bottom 0.254: U$4.9 3,31.77 3,35 3.85,35.85 TC54.1 7.15,39 PMV22.1 9.55,40.5 v10.5,40.5 11,41 v17.5,41
RX  (via drill 0.6)
  Top 0.254: MCU.20 9.51,26.72 8.28,26.72 v8,27 | JP2.4 42.31,17.69 41,19 41,36 40.5,36.5 39,36.5 37.5,38 37.5,40 35.5,42 21.5,42 v21,41.5
  Bottom 0.254: v8,27 7.5,27.5 7,27.5 6.5,28 6.5,29 6,29.5 6,30.5 7,31.5 15.5,31.5 16,32 17,32 20,35 20,39 21,40 v21,41.5
SCL  (via drill 0.6)
  Top 0.254: MCU.18 7.64,30 v7,30 | v32,26 32,27.27 31.61,27.66 LSM9DS0.21 31.61,31.61 v32,32
  Bottom 0.254: v7,30 12.5,30 16,26.5 16,25.5 21.5,20 22.5,20 23.5,21 28,21 29,22 29,28.5 29.5,29 29.5,29.73 30.22,30.45 31.45,30.45 32,31 v32,32 | JP2.1 40.5,11.95 40.5,20.5 40,21 38.27,21 37.73,21.55 36.52,21.55 36.23,21.83 32.67,21.83 32,22.5 v32,26
SCLK  (via drill 0.6)
  Top 0.254: MCU.9 16,29.43 v16,29.5 | v32.5,15.5 31,15.5 30,14.5 26.5,14.5 25.5,15.5 25.5,16.5 24.5,17.5 24.5,24 25,24.5 v25.5,24.5 | v35,24 35,22.27 v33.47,20.74
  Bottom 0.254: SD.5 22.5,6.18 22.5,7.5 23,8 26.86,8 27.18,7.68 27.18,6.33 28.5,5 28.5,3.5 31.5,3.5 32.5,4.5 ISP1.3 33,5.27 33,6 35.5,8.5 35.5,14 33.25,16.25 | 33.25,16.25 33.11,16.39 RF_MODULE.12 33.11,20.61 33.24,20.74 v33.47,20.74 | v32.5,15.5 33.25,16.25 | v25.5,24.5 22,24.5 17,29.5 v16,29.5 | v35,24 35,24.5 35.5,25 42.06,25 JP2.7
SDA  (via drill 0.6)
  Top 0.254: MCU.19 8.44,28.5 v7.5,28.5 | LSM9DS0.24 30.11,28.93 v30.66,29.48
  Bottom 0.254: v7.5,28.5 13,28.5 15,26.5 15,25.5 21,19.5 23.5,19.5 23.5,20 24,20.5 28.5,20.5 30,22 30,26.2 30.8,27 | JP2.2 41,13.98 41,20.77 40.27,21.5 38.5,21.5 38,22 37,22 36.5,22.5 33,22.5 33,26.5 32.5,27 30.8,27 | 30.8,27 30.66,27.14 v30.66,29.48
SHDN  (via drill 0.6)
  Top 0.254: U$4.8 1.62,27.2 3.29,25.53 4.51,25.53 5,25.05 5,23.14 5.74,22.41 v6.28,22.41 | v5.99,18.63 MCU.26
  Bottom 0.254: 6.28,18.91 v5.99,18.63 6.28,18.92 v6.28,22.41
TX  (via drill 0.6)
  Top 0.254: MCU.21 9.52,26 9.5,26 9.29,26.21 8.81,26.21 8.1,25.5 v7.5,25.5 | JP2.3 41.35,15.15 40.5,16 40.5,35.5 40,36 38.5,36 37,37.5 37,39.5 35,41.5 22.5,41.5 21.5,40.5 v19.5,40.5
  Bottom 0.254: v7.5,25.5 7,26 7,26.5 6,27.5 6,28.5 5.5,29 5.5,31 6.5,32 15,32 15.5,32.5 16.5,32.5 19.5,35.5 v19.5,40.5
UVCC  (via drill 0.6)
  Top 0.254: JP1.VBUS 10.3,6.7 10,7 8,7 6.5,8.5 6.5,13 8.5,15 v8.5,18 | MCU.2 17.32,25.82 16.82,25.32 16.18,25.32 16,25.5 | MCU.7 15.04,27.06 15.04,26.45 16,25.5 | 16,25.5 13.96,25.5 v12.29,23.84
  Bottom 0.254: v12.29,23.84 11.84,23.84 8,20 8,18.5 v8.5,18
VBUS  (via drill 0.6)
  Top 0.254: U1.8 14.53,35.23 v14.53,34.81
  Bottom 0.254: U$4.7 3,26.68 | 3,26.68 3,30.5 5,32.5 TC54.3 | 3,26.68 3,21.61 U$4.5 1.62,19.88 3,18.5 3,12 3.65,11.35 D2.A | TC54.3 5.07,33.08 | v14.53,34.81 15.15,34.19 R8.2 15.15,33.15 14.5,32.5 10,32.5 9.57,32.92 DMP.2 arc-90 8.53,32.5 5.65,32.5 TC54.3
VCC
  Top 0.254: ISP1.2 35.04,2.46 34,3.5 27.5,3.5 25,1 22.5,1 22.5,1.88 D4.C D3.C
VSOL
  Top 0.254: U$4.2 3.54,12.61 D1.A
VSW  (via drill 0.6)
  Top 0.254: R6.2 9.5,34.5 9.5,30.97 MCU.14 13,27.47 13,27 12.57,26.57 12.57,25.25 12.07,24.75 10.93,24.75 10.49,24.32 | R6.2 10.85,33.5 12.35,33.5 R2.2 | U$4.6 2.23,22.77 4,21 6.86,21 MCU.24 10.18,24.32 10.49,24.32 | MCU.34 12.16,22.66 | 12.16,22.66 10.49,24.32 | v20.5,14 22,15.5 22,23.5 21,24.5 | 21,24.5 21,27 21.25,27 v21.52,27.27 | 34.15,28.52 LSM9DS0.18 LSM9DS0.17 LSM9DS0.16 LSM9DS0.15 | 34.15,28.52 R11.2 34.15,31.35 v34,31.5 | R10.2 34.16,28.52 34.15,28.52 | v25,28 27,30 C8.2 | C8.2 25.08,31.42 23.5,33 C9.A | C8.2 27,31.5 28.5,31.5 29,32 30,32 v30.39,32.38 | R6.2 10.85,35.15 v10,36 | 12.16,22.66 12.39,22.66 14.54,24.8 17.09,24.8 MCU.44 18.39,23.5 20,23.5 21,24.5
  Bottom 0.254: 11.35,34 arc-90 R7.2 | SD.4 21.5,5.83 21.5,8 23,9.5 23.5,9.5 24,10 24,12 23,13 21.5,13 v20.5,14 | v25,28 24.27,27.27 v21.52,27.27 | v34,31.5 33.11,32.39 33.11,33.5 | 33.11,33.5 RF_MODULE.5 | 33.11,33.5 32.61,33 31,33 v30.39,32.38 | v10,36 12.5,36 12.5,34 11.65,34 R7.2 | DMP.3 11.47,33.88 arc-90 R7.2

### Text on the board
tPlace: PocketQube OBC | V. 2.0 | Rev. A